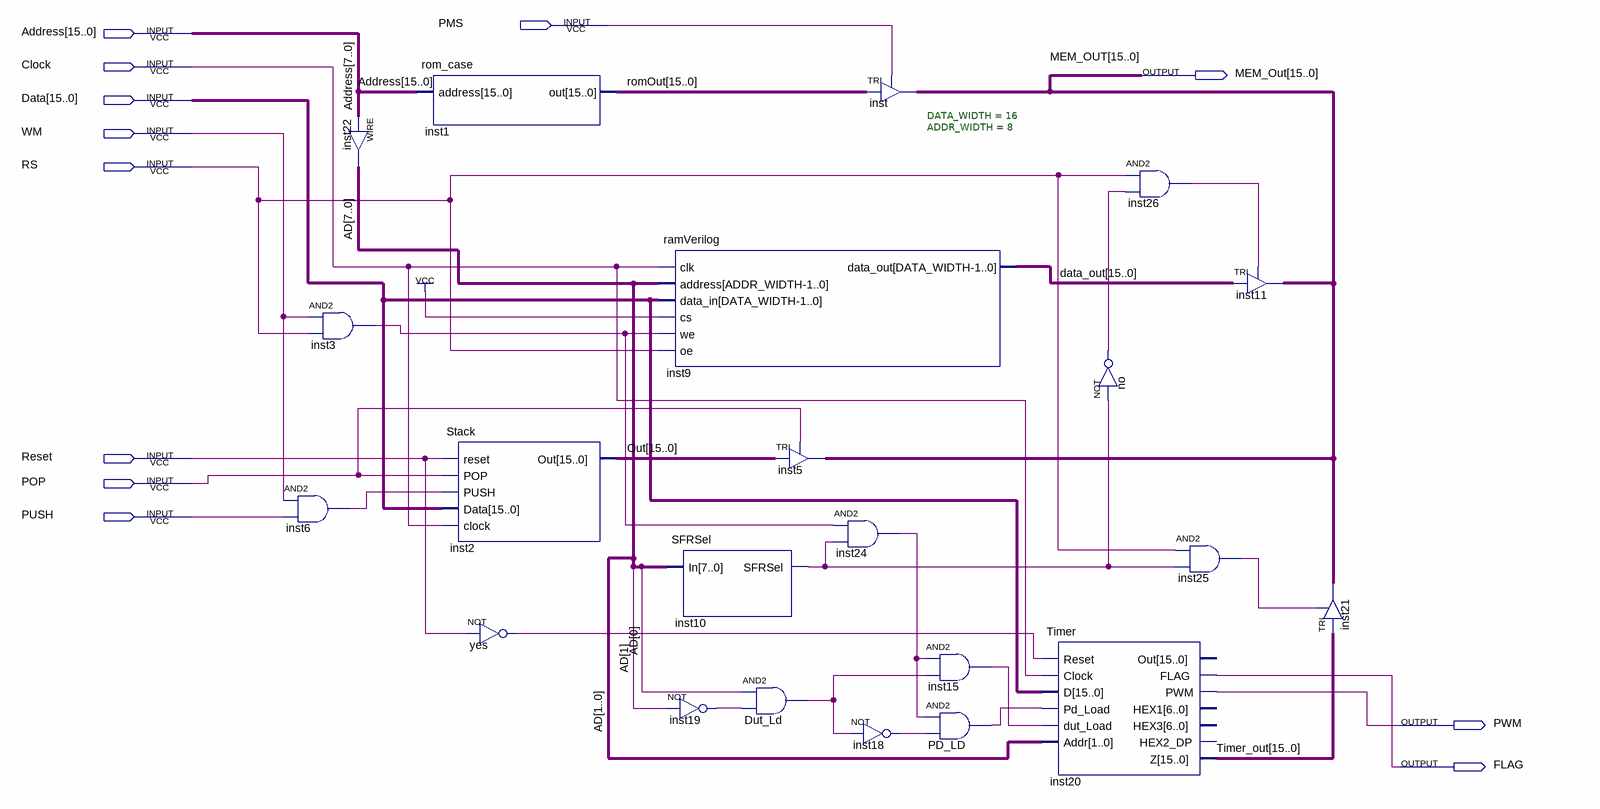
[diagram p0: schematic sheet]
// Quartus schematic MemoryBlock.bdf as structural Verilog: 22 symbols, 12 pins
module MemoryBlock (
  input  PMS,
  input  [15:0] Address,
  input  Clock,
  input  [15:0] Data,
  input  WM,
  input  RS,
  input  Reset,
  input  POP,
  input  PUSH,
  output [15:0] MEM_Out,
  output PWM,
  output FLAG
);

  wire Dut_Ld_out, inst3_out, inst6_out, inst10_sfrsel, inst15_out, inst18_out, inst19_out, inst24_out,
       inst25_out, inst26_out, no_out, PD_LD_out, yes_out;
  wire [7:0] AD;
  wire [15:0] data_out, Out, romOut, Timer_out;

  and inst3 (inst3_out, WM, RS);
  and inst6 (inst6_out, WM, PUSH);
  assign AD = Address[7:0];  // WIRE inst22
  rom_case inst1 (.address(Address), .out(romOut));
  Stack inst2 (.reset(Reset), .POP(POP), .PUSH(inst6_out), .Data(Data), .clock(Clock), .Out(Out));
  not yes (yes_out, Reset);
  ramVerilog #(.DATA_WIDTH(16), .ADDR_WIDTH(8)) inst9 (
    .clk(Clock), .address(AD), .data_in(Data), .cs(1'b1), .we(inst3_out), .oe(RS), .data_out(data_out));
  SFRSel inst10 (.In(AD), .SFRSel(inst10_sfrsel));
  not inst19 (inst19_out, AD[1]);
  TRI inst5[15:0] (.IN(Out), .OE(POP), .OUT(MEM_Out));
  and Dut_Ld (Dut_Ld_out, AD[0], inst19_out);
  and inst24 (inst24_out, inst3_out, inst10_sfrsel);
  TRI inst[15:0] (.IN(romOut), .OE(PMS), .OUT(MEM_Out));
  not inst18 (inst18_out, Dut_Ld_out);
  and inst15 (inst15_out, inst24_out, Dut_Ld_out);
  and PD_LD (PD_LD_out, inst24_out, inst18_out);
  Timer inst20 (
    .Reset(yes_out), .Clock(Clock), .D(Data), .Pd_Load(PD_LD_out), .dut_Load(inst15_out), .Addr(AD[1:0]),
    .FLAG(FLAG), .PWM(PWM), .Z(Timer_out));  // open: Out, HEX1, HEX3, HEX2_DP
  not no (no_out, inst10_sfrsel);
  and inst26 (inst26_out, RS, no_out);
  and inst25 (inst25_out, RS, inst10_sfrsel);
  TRI inst11[15:0] (.IN(data_out), .OE(inst26_out), .OUT(MEM_Out));
  TRI inst21[15:0] (.IN(Timer_out), .OE(inst25_out), .OUT(MEM_Out));
endmodule
